# Altium schematic sheet Умножитель.SchDoc: Интерфейсный модуль ФЭУ-92
size A3; Address1: (с) Быканов Андрей; Address2: г.Тула 2016г.; Revision: 1.3
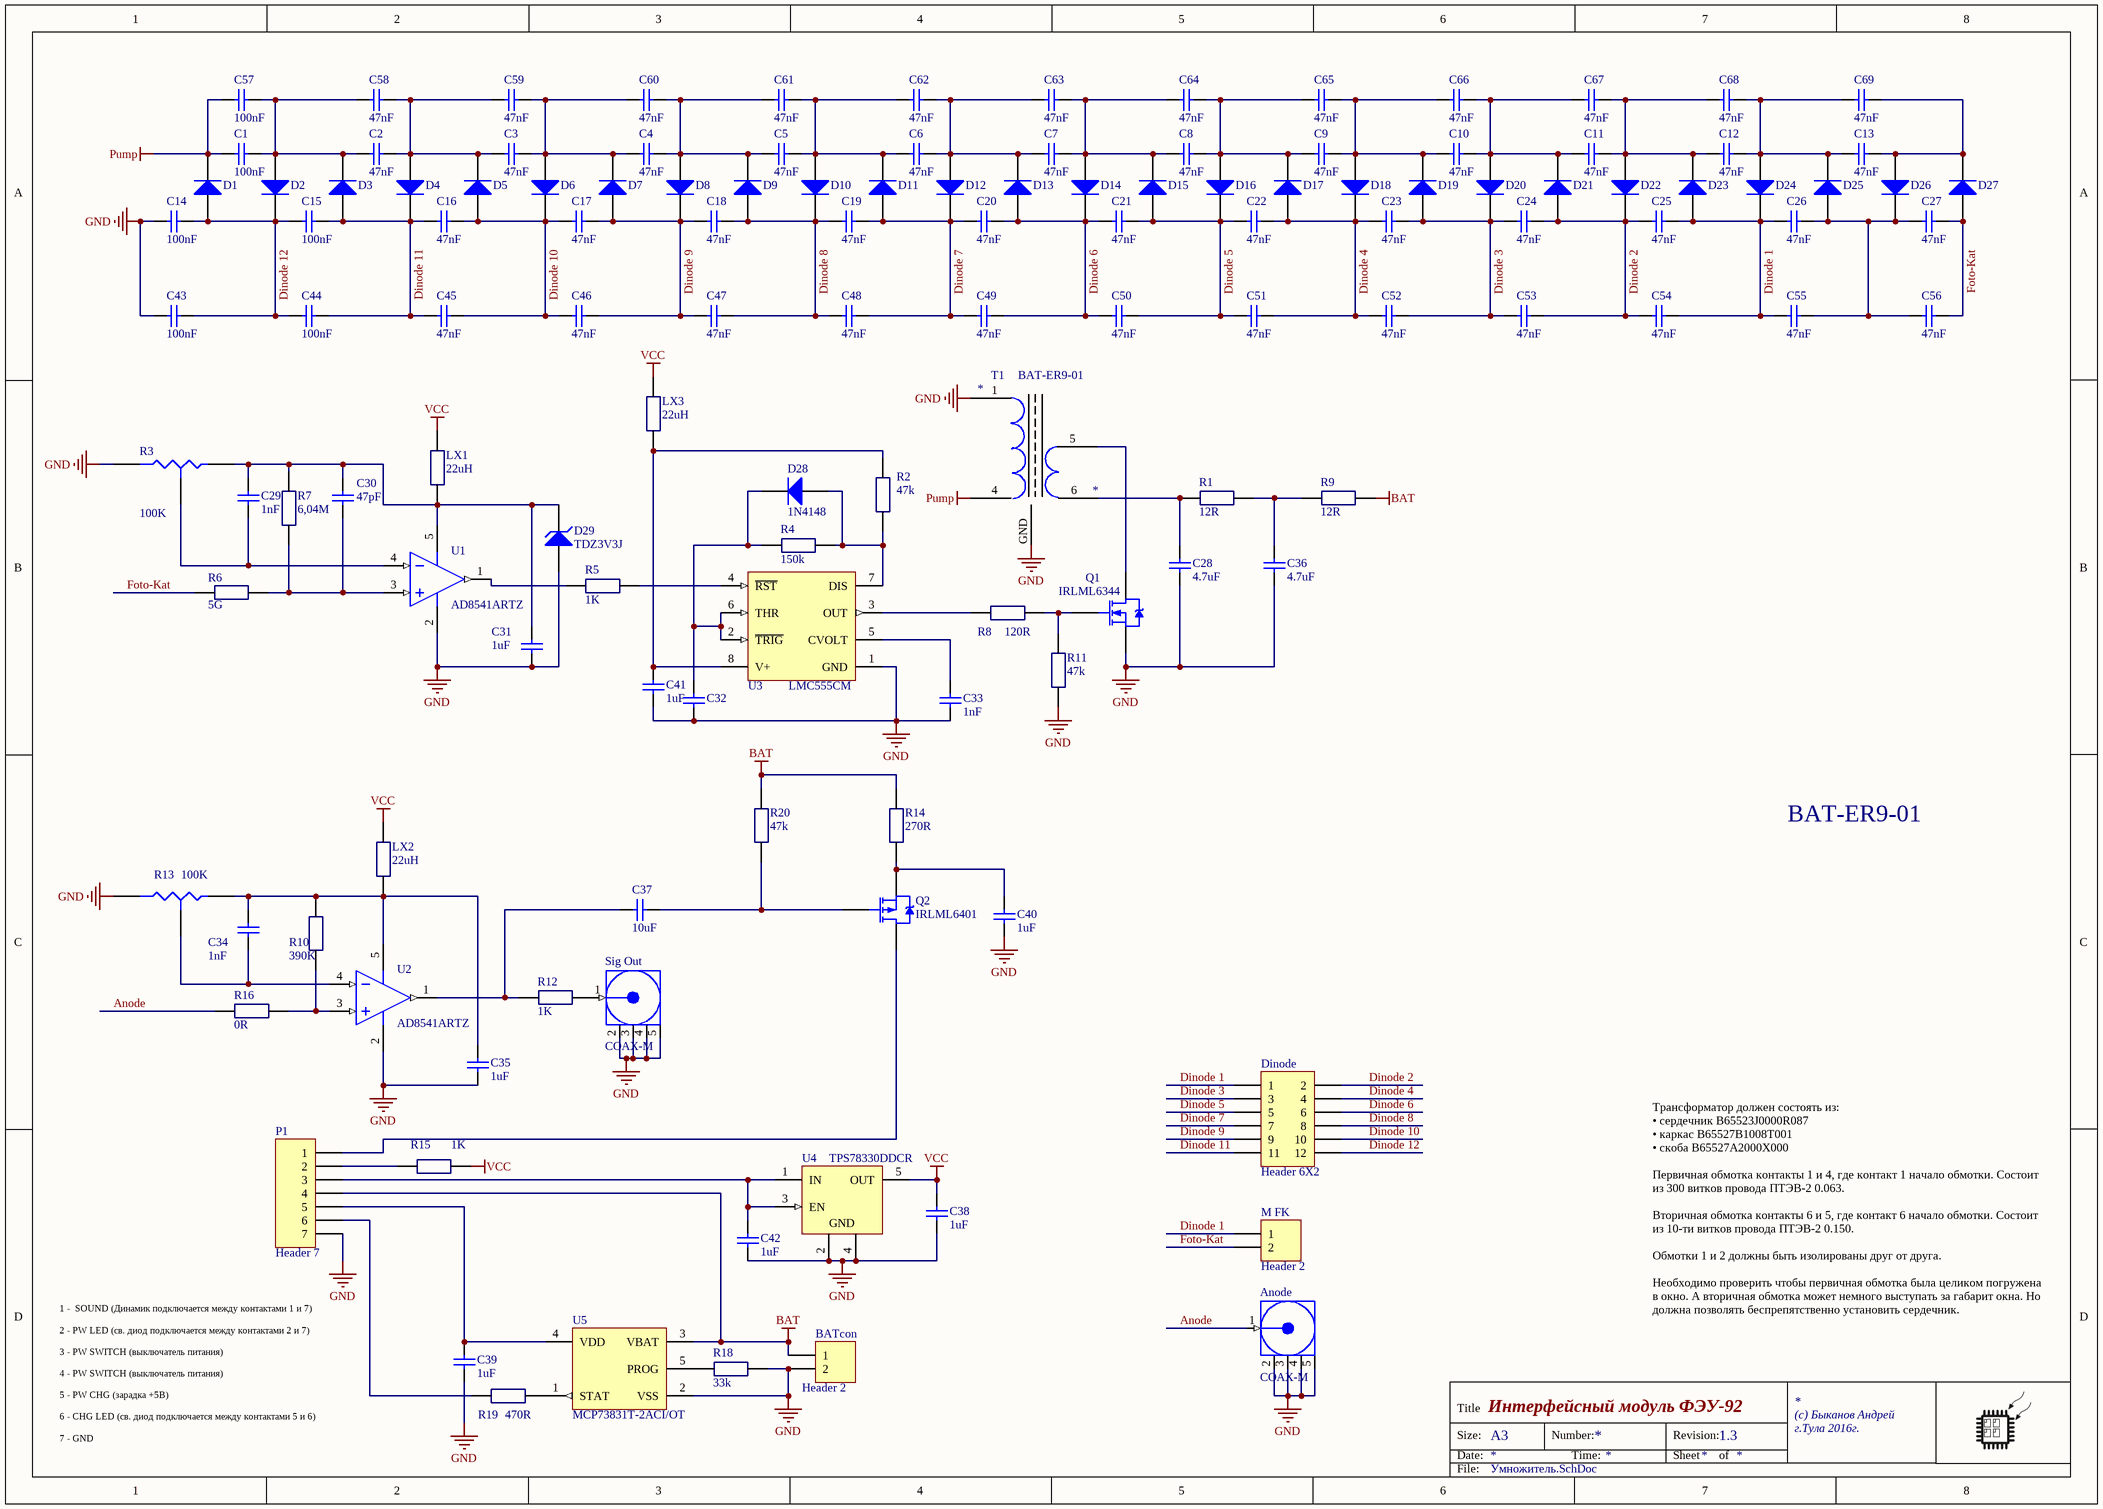
[diagram p0: Умножитель.SchDoc]

## Parts
Anode  COAX-M  [MMCX2.54-V5]  (no BOM)
BATcon  Header 2  [LIR2430]
C1  100nF  [C1206]
C2  47nF  [0805_CAP]
C3  47nF  [0805_CAP]
C4  47nF  [0805_CAP]
C5  47nF  [0805_CAP]
C6  47nF  [0805_CAP]
C7  47nF  [0805_CAP]
C8  47nF  [0805_CAP]
C9  47nF  [0805_CAP]
C10  47nF  [0805_CAP]
C11  47nF  [0805_CAP]
C12  47nF  [0805_CAP]
C13  47nF  [0805_CAP]
C14  100nF  [C1206]
C15  100nF  [C1206]
C16  47nF  [0805_CAP]
C17  47nF  [0805_CAP]
C18  47nF  [0805_CAP]
C19  47nF  [0805_CAP]
C20  47nF  [0805_CAP]
C21  47nF  [0805_CAP]
C22  47nF  [0805_CAP]
C23  47nF  [0805_CAP]
C24  47nF  [0805_CAP]
C25  47nF  [0805_CAP]
C26  47nF  [0805_CAP]
C27  47nF  [0805_CAP]
C28  4.7uF  [C1206]
C29  1nF  [1608[0603]_CAP]
C30  47pF  [1608[0603]_CAP]
C31  1uF  [1608[0603]_CAP]
C32  220pF  [1608[0603]_CAP]  (value not drawn)
C33  1nF  [1608[0603]_CAP]
C34  1nF  [1608[0603]_CAP]
C35  1uF  [1608[0603]_CAP]
C36  4.7uF  [C1206]
C37  10uF  [1608[0603]_CAP]
C38  1uF  [1608[0603]_CAP]
C39  1uF  [1608[0603]_CAP]
C40  1uF  [1608[0603]_CAP]
C41  1uF  [1608[0603]_CAP]
C42  1uF  [1608[0603]_CAP]
C43  100nF  [C1206]
C44  100nF  [C1206]
C45  47nF  [0805_CAP]
C46  47nF  [0805_CAP]
C47  47nF  [0805_CAP]
C48  47nF  [0805_CAP]
C49  47nF  [0805_CAP]
C50  47nF  [0805_CAP]
C51  47nF  [0805_CAP]
C52  47nF  [0805_CAP]
C53  47nF  [0805_CAP]
C54  47nF  [0805_CAP]
C55  47nF  [0805_CAP]
C56  47nF  [0805_CAP]
C57  100nF  [C1206]
C58  47nF  [0805_CAP]
C59  47nF  [0805_CAP]
C60  47nF  [0805_CAP]
C61  47nF  [0805_CAP]
C62  47nF  [0805_CAP]
C63  47nF  [0805_CAP]
C64  47nF  [0805_CAP]
C65  47nF  [0805_CAP]
C66  47nF  [0805_CAP]
C67  47nF  [0805_CAP]
C68  47nF  [0805_CAP]
C69  47nF  [0805_CAP]
D1  (no value)  [DA2JF8100L]
D2  (no value)  [DA2JF8100L]
D3  (no value)  [DA2JF8100L]
D4  (no value)  [DA2JF8100L]
D5  (no value)  [DA2JF8100L]
D6  (no value)  [DA2JF8100L]
D7  (no value)  [DA2JF8100L]
D8  (no value)  [DA2JF8100L]
D9  (no value)  [DA2JF8100L]
D10  (no value)  [DA2JF8100L]
D11  (no value)  [DA2JF8100L]
D12  (no value)  [DA2JF8100L]
D13  (no value)  [DA2JF8100L]
D14  (no value)  [DA2JF8100L]
D15  (no value)  [DA2JF8100L]
D16  (no value)  [DA2JF8100L]
D17  (no value)  [DA2JF8100L]
D18  (no value)  [DA2JF8100L]
D19  (no value)  [DA2JF8100L]
D20  (no value)  [DA2JF8100L]
D21  (no value)  [DA2JF8100L]
D22  (no value)  [DA2JF8100L]
D23  (no value)  [DA2JF8100L]
D24  (no value)  [DA2JF8100L]
D25  (no value)  [DA2JF8100L]
D26  (no value)  [DA2JF8100L]
D27  (no value)  [DA2JF8100L]
D28  1N4148  [GRZZ0002ZB-A]
D29  TDZ3V3J  [SC-90]
Dinode  Header 6X2  [HDR2X6]  (no BOM)
LX1  22uH  [Resistor]
LX2  22uH  [Resistor]
LX3  22uH  [Resistor]
M_FK  Header 2  [HDR1X2]  (no BOM)
P1  Header 7  [HDR1X7]
Q1  IRLML6344  [SOT-23_N]
Q2  IRLML6401  [Micro3_N]
R1  12R  [1608[0603]_RES]
R2  47k  [1608[0603]_RES]
R3  100K  [3223W]
R4  150k  [1608[0603]_RES]
R5  1K  [1608[0603]]
R6  5G  [HVF2512T5007FE]
R7  6,04M  [1608[0603]]
R8  120R  [1608[0603]_RES]
R9  12R  [1608[0603]_RES]
R10  390K  [1608[0603]]
R11  47k  [1608[0603]_RES]
R12  1K  [1608[0603]]
R13  100K  [3223W]
R14  270R  [1608[0603]_RES]
R15  1K  [1608[0603]_RES]
R16  0R  [1608[0603]]
R18  33k  [1608[0603]_RES]
R19  470R  [1608[0603]_RES]
R20  47k  [1608[0603]_RES]
Sig_Out  COAX-M  [MMCX2.54-V5]  (no BOM)
T1  BAT-ER9-01  [Epcos ER9.5/5]
U1  AD8541ARTZ  [ADI-RJ-5_N]
U2  AD8541ARTZ  [ADI-RJ-5_N]
U3  LMC555CM  [M08A_N]
U4  TPS78330DDCR  [TI-DDC5_N]
U5  MCP73831T-2ACI/OT  [SOT-23-OT5_N]

## Nets
BAT: BATcon.1 P1.4 R9.2 R14.2 R20.1(A) U5.3(VBAT)
GND: Anode.2(GND) Anode.3(GND) Anode.4(GND) Anode.5(GND) BATcon.2 C14.2 C28.2 C31.2 C32.1 C33.2 C35.2 C36.2 C38.1 C39.2 C40.2 C41.2 C42.2 C43.2 D29.1(A) P1.7 Q1.2(S) R3.2(B) R11.1(A) R13.2(B) R18.2 Sig_Out.2(GND) Sig_Out.3(GND) Sig_Out.4(GND) Sig_Out.5(GND) T1.1 T1.GND U1.2(-V) U2.2(-V) U3.1(GND) U4.2(GND) U4.4(GND) U5.2(VSS)
Pump: C1.2 C57.2 D1.2(K) T1.4
VCC: C38.2 LX1.1(A) LX2.1(A) LX3.1(A) R15.1(A) U4.5(OUT)
Anode: Anode.1(Signal) R16.1(A)
Dinode 1: C25.1 C26.2 C54.1 C55.2 D23.1(A) D24.2(K) Dinode.1 M_FK.1
Dinode 2: C24.1 C25.2 C53.1 C54.2 D21.1(A) D22.2(K) Dinode.2
Dinode 3: C23.1 C24.2 C52.1 C53.2 D19.1(A) D20.2(K) Dinode.3
Dinode 4: C22.1 C23.2 C51.1 C52.2 D17.1(A) D18.2(K) Dinode.4
Dinode 5: C21.1 C22.2 C50.1 C51.2 D15.1(A) D16.2(K) Dinode.5
Dinode 6: C20.1 C21.2 C49.1 C50.2 D13.1(A) D14.2(K) Dinode.6
Dinode 7: C19.1 C20.2 C48.1 C49.2 D11.1(A) D12.2(K) Dinode.7
Dinode 8: C18.1 C19.2 C47.1 C48.2 D9.1(A) D10.2(K) Dinode.8
Dinode 9: C17.1 C18.2 C46.1 C47.2 D7.1(A) D8.2(K) Dinode.9
Dinode 10: C16.1 C17.2 C45.1 C46.2 D5.1(A) D6.2(K) Dinode.10
Dinode 11: C15.1 C16.2 C44.1 C45.2 D3.1(A) D4.2(K) Dinode.11
Dinode 12: C14.1 C15.2 C43.1 C44.2 D1.1(A) D2.2(K) Dinode.12
Foto-Kat: C27.1 C56.1 D27.1(A) M_FK.2 R6.1(A)
NetC1_1: C1.1 C2.2 C57.1 C58.2 D2.1(A) D3.2(K)
NetC2_1: C2.1 C3.2 C58.1 C59.2 D4.1(A) D5.2(K)
NetC3_1: C3.1 C4.2 C59.1 C60.2 D6.1(A) D7.2(K)
NetC4_1: C4.1 C5.2 C60.1 C61.2 D8.1(A) D9.2(K)
NetC5_1: C5.1 C6.2 C61.1 C62.2 D10.1(A) D11.2(K)
NetC6_1: C6.1 C7.2 C62.1 C63.2 D12.1(A) D13.2(K)
NetC7_1: C7.1 C8.2 C63.1 C64.2 D14.1(A) D15.2(K)
NetC8_1: C8.1 C9.2 C64.1 C65.2 D16.1(A) D17.2(K)
NetC9_1: C9.1 C10.2 C65.1 C66.2 D18.1(A) D19.2(K)
NetC10_1: C10.1 C11.2 C66.1 C67.2 D20.1(A) D21.2(K)
NetC11_1: C11.1 C12.2 C67.1 C68.2 D22.1(A) D23.2(K)
NetC12_1: C12.1 C13.2 C68.1 C69.2 D24.1(A) D25.2(K)
NetC13_1: C13.1 C69.1 D26.1(A) D27.2(K)
NetC26_1: C26.1 C27.2 C55.1 C56.2 D25.1(A) D26.2(K)
NetC28_1: C28.1 R1.1(A) T1.6
NetC29_1: C29.1 C30.1 C31.1 D29.2(K) LX1.2 R3.1(A) R7.1(A) U1.5(+V)
NetC29_2: C29.2 R3.3(TAP) U1.4(-IN_A)
NetC30_2: C30.2 R6.2 R7.2 U1.3(+IN_A)
NetC32_2: C32.2 D28.1(K) R4.1(A) U3.2(~{TRIG}) U3.6(THR)
NetC33_1: C33.1 U3.5(CVOLT)
NetC34_1: C34.1 C35.1 LX2.2 R10.2 R13.1(A) U2.5(+V)
NetC34_2: C34.2 R13.3(TAP) U2.4(-IN_A)
NetC36_1: C36.1 R1.2 R9.1(A)
NetC37_1: C37.1 R12.2 U2.1(OUT_A)
NetC37_2: C37.2 Q2.1(G) R20.2
NetC39_1: C39.1 P1.5 U5.4(VDD)
NetC40_1: C40.1 Q2.2(S) R14.1(A)
NetC41_1: C41.1 LX3.2 R2.2 U3.8(V+)
NetC42_1: C42.1 P1.3 U4.1(IN) U4.3(EN)
NetD28_2: D28.2(A) R2.1(A) R4.2 U3.7(DIS)
NetP1_1: P1.1 Q2.3(D)
NetP1_2: P1.2 R15.2
NetP1_6: P1.6 R19.2
NetQ1_1: Q1.1(G) R8.1(A) R11.2
NetQ1_3: Q1.3(D) T1.5
NetR5_1: R5.1(A) U1.1(OUT_A)
NetR5_2: R5.2 U3.4(~{RST})
NetR8_2: R8.2 U3.3(OUT)
NetR10_1: R10.1(A) R16.2 U2.3(+IN_A)
NetR12_1: R12.1(A) Sig_Out.1(Signal)
NetR18_1: R18.1(A) U5.5(PROG)
NetR19_1: R19.1(A) U5.1(STAT)

## Notes on the sheet
- BAT-ER9-01
- Трансформатор должен состоять из:
  •	сердечник B65523J0000R087
  •	каркас B65527B1008T001
  •	скоба B65527A2000X000
  Первичная обмотка контакты 1 и 4, где контакт 1 начало обмотки. Состоит из 300 витков провода ПТЭВ-2 0.063.
  Вторичная обмотка контакты 6 и 5, где контакт 6 начало обмотки. Состоит из 10-ти витков провода ПТЭВ-2 0.150.
  Обмотки 1 и 2 должны быть изолированы друг от друга.
  Необходимо проверить чтобы первичная обмотка была целиком погружена в окно. А вторичная обмотка может немного выступать за габарит окна. Но должна позволять беспрепятственно установить сердечник.
- 1 -  SOUND (Динамик подключается между контактами 1 и 7)
  2 - PW LED (св. диод подключается между контактами 2 и 7)
  3 - PW SWITCH (выключатель питания)
  4 - PW SWITCH (выключатель питания)
  5 - PW CHG (зарадка +5В)
  6 - CHG LED (св. диод подключается между контактами 5 и 6)
  7 - GND
- Title
- Size:
- Date:
- A3
- Number:
- Time:
- Revision:
- Sheet
- of
- File:

## Library data of the parts
Anode Sig_Out = COAX-M: RF Coaxial PCB Connector, MMCX; Thru-Hole, Vertical Mount Plug,  50 Ohm Impedance; PackageDocument: Rev. A, 16-Jun-1997; PCB_Layout: Complies with manufacturer's recommendation.; DrillSize: Corresponds to nominal value.; Published: 15-Jul-2004; LatestRevisionDate: 15-Jul-2004; LatestRevisionNote: Component Replaced.; DatasheetDocument: 30-May-2003; PackageReference: 908-21103; Publisher: Altium Limited; ComponentLink1Description: Manufacturer Link; ComponentLink1URL: http://www.amphenolrf.com/
BATcon M_FK = Header 2: Header, 2-Pin; LatestRevisionDate: 17-Jul-2002; LatestRevisionNote: Re-released for DXP Platform.; Publisher: Altium Limited
  BATcon: Order: LIR2430
C1 C14 C15 C43 C44 C57 = Cap Semi: Capacitor (Semiconductor SIM Model); Order: CGA5L4X7T2W104K; Published: 8-Jun-2000; LatestRevisionDate: 29-May-2009; LatestRevisionNote: IPC-7351 Footprint Added.; PackageReference: C1206; Publisher: Altium Limited; PackageDescription: Chip Capacitor; Value: 100nF
C2-C13 C16-C27 C45-C56 C58-C69 = Cap Semi: Capacitor (Semiconductor SIM Model); Order: CGA4J4X7T2W473M/SOFT; Published: 8-Jun-2000; LatestRevisionDate: 29-May-2009; LatestRevisionNote: IPC-7351 Footprint Added.; PackageReference: C1206; Publisher: Altium Limited; PackageDescription: Chip Capacitor; Value: 47nF
C28 C36 = Cap Semi: Capacitor (Semiconductor SIM Model); Order: CC1206KKX7R8BB475; Published: 8-Jun-2000; LatestRevisionDate: 29-May-2009; LatestRevisionNote: IPC-7351 Footprint Added.; PackageReference: C1206; Publisher: Altium Limited; PackageDescription: Chip Capacitor; Value: 4.7uF
C29 C33 C34 = Cap Semi: Capacitor (Semiconductor SIM Model); Order: CC0603JRNPO9BN102; Published: 8-Jun-2000; LatestRevisionDate: 29-May-2009; LatestRevisionNote: IPC-7351 Footprint Added.; Publisher: Altium Limited; PackageDescription: Chip Capacitor; Value: 1nF
  C29 C34: PackageReference: C0402
  C33: PackageReference: C1206
C30 = Cap Semi: Capacitor (Semiconductor SIM Model); Order: CC0603JRNPOABN470; Published: 8-Jun-2000; LatestRevisionDate: 29-May-2009; LatestRevisionNote: IPC-7351 Footprint Added.; PackageReference: C0402; Publisher: Altium Limited; PackageDescription: Chip Capacitor; Value: 47pF
C31 C35 C38-C42 = Cap Semi: Capacitor (Semiconductor SIM Model); Order: CC0603KRX5R7BB105; Published: 8-Jun-2000; LatestRevisionDate: 29-May-2009; LatestRevisionNote: IPC-7351 Footprint Added.; Publisher: Altium Limited; PackageDescription: Chip Capacitor; Value: 1uF
  C31 C35: PackageReference: C1206
  C38-C42: PackageReference: C0402
C32 = Cap Semi: Capacitor (Semiconductor SIM Model); Order: CC0603JRNPO9BN221; Published: 8-Jun-2000; LatestRevisionDate: 29-May-2009; LatestRevisionNote: IPC-7351 Footprint Added.; PackageReference: C1206; Publisher: Altium Limited; PackageDescription: Chip Capacitor; Value: 220pF
C37 = Cap Semi: Capacitor (Semiconductor SIM Model); Order: GRM188R60J106ME47D; Published: 8-Jun-2000; LatestRevisionDate: 29-May-2009; LatestRevisionNote: IPC-7351 Footprint Added.; PackageReference: C0402; Publisher: Altium Limited; PackageDescription: Chip Capacitor; Value: 10uF
D1-D27 = Diode: Default Diode; Value: DA2JF8100L; Published: 8-Jun-2000; LatestRevisionDate: 17-Jul-2002; LatestRevisionNote: Re-released for DXP Platform.; PackageVersion: Sep-1996; PackageReference: SMC; Publisher: Altium Limited; PackageDescription: DO-214-AB/SMC; 2 C-Bend Leads; Body 7.9 x 5.9 mm, inc. leads (LxW); Code_JEDEC: DO-214-AB; Order: DA2JF8100L
D28 = 1N4148: Silicon Epitaxial Planar Diode for Various Detector, Modulator, Demodulator; Published: 12-Feb-2010; DatasheetVersion: Rev.5.00, Jul-2006; PackageVersion: Aug-2005; PackageReference: GRZZ0002ZB-A; Publisher: Altium Limited; PackageDescription: Diode, Axial; Body 4.2 x 2.0 mm (LxDia.), Lead Dia. 0.5 mm (nom); Code_JEITA: SC-40; ComponentLink1Description: Manufacturer Link; ComponentLink1URL: http://sg.renesas.com/fmwk.jsp?cnt=diode_landing.jsp&fp=/products/discrete/diodes/; ComponentLink2Description: Datasheet; ComponentLink2URL: http://documentation.renesas.com/eng/products/diode/rej03g0556_1n4148.pdf; ComponentLink3Description: Packaging Specification; ComponentLink3URL: http://sg.renesas.com/media/products/common_info/package/pdf/diode/code/grzz0002zb_a.pdf; Order: 1N4148
D29 = D Zener: Zener Diode; Published: 8-Jun-2000; LatestRevisionDate: 17-Jul-2002; LatestRevisionNote: Re-released for DXP Platform.; PackageReference: DIODE-0.7; Publisher: Altium Limited; PackageDescription: Diode, Thru-Hole; 2 Leads; 0.7 in Pin Spacing; Order: TDZ3V3J
Dinode = Header 6X2: Header, 6-Pin, Dual row; LatestRevisionDate: 17-Jul-2002; LatestRevisionNote: Re-released for DXP Platform.; Publisher: Altium Limited
LX1-LX3 = Resistor 0805: Order: LQM21FN220N00L; Value: 22uH
P1 = Header 7: Header, 7-Pin; LatestRevisionDate: 17-Jul-2002; LatestRevisionNote: Re-released for DXP Platform.; Publisher: Altium Limited
Q1 = IRLML2402: HEXFET Power MOSFET; Published: 8-Jun-2000; LatestRevisionDate: 20-Nov-2009; LatestRevisionNote: IPC-7351 Footprint Added.; DatasheetVersion: Aug-1997; PackageReference: SOT-23; Publisher: Altium Limited; PackageDescription: 3-Pin SOT-23 Package 0.95 mm Pitch, 2.3 mm Lead Span; ComponentLink1Description: Manufacturer Link; ComponentLink1URL: http://www.irf.com/; ComponentLink2Description: Datasheet; ComponentLink2URL: http://www.irf.com/product-info/datasheets/data/irlml2402.pdf; Order: IRLML6344
Q2 = IRLML6401: HEXFET Power MOSFET; Published: 17-Sep-2003; DatasheetVersion: 2-Jul-2001; PackageVersion: Jul-2001; PackageReference: Micro3; Publisher: Altium Limited; PackageDescription: 3-Pin SOT-23 Package 0.95 mm Pitch, 2.3 mm Lead Span; ComponentLink1Description: Manufacturer Link; ComponentLink1URL: http://www.irf.com/; ComponentLink2Description: Datasheet; ComponentLink2URL: http://www.irf.com/product-info/datasheets/data/IRLML6401.pdf; Order: IRLML6401
R1 R9 = Resistor 0805: Order: ERJ3GEYJ120V; Avail: 20; Value: 12R
R2 R11 R20 = Resistor 0805: Order: RC0603FR-0747KL; Avail: 20; Value: 47k
R3 R13 = Res Tap: Tapped Resistor; Sim Note: Enter the Resistance value and the set point into parameter fields.; Set Position: 0.5; Order: 3223W-1-104E; Published: 24-Mar-1999; LatestRevisionDate: 17-Jul-2002; LatestRevisionNote: Re-released for DXP Platform.; PackageReference: VR3; Publisher: Altium Limited; PackageDescription: Variable Resistor, Thru-Hole; 3 Leads; Value: 100K
R4 = Resistor 0805: Order: RC0603FR-07150KL; Avail: 20; Value: 150k
R5 R12 = Resistor 0805: Order: RC0603FR-101KL; Value: 1K
R6 = Resistor 0805: Order: HVF2512T5007FE; Value: 5G
R7 = Resistor 0805: Order: CRCW06036M04FKEA; Value: 6,04M
R8 = Resistor 0805: Order: RC0603FR-07120RL; Value: 120R
R10 = Resistor 0805: Order: RC0603FR-07390KL; Value: 390K
R14 = Resistor 0805: Order: RC0805FR-07270RL; Avail: 20; Value: 270R
R15 = Resistor 0805: Order: RC0603FR-101KL; Avail: 20; Value: 1K
R16 = Resistor 0805: Order: RC0603JR-100RL; Value: 0R
R18 = Resistor 0805: Order: RC0603FR-0733KL; Avail: 20; Value: 33k
R19 = Resistor 0805: Order: RC0603JR-07470RL; Value: 470R
T1 = Epcos ER9.5/5: Order: BAT-ER9-01
U1 U2 = AD8541ARTZ-R2: Single Channel RRIO Operational Amplifier, 1 MHz BW, 920 mV/us SR, Industrial, 5-pin SOT23 (RJ-5), Reel; Generic Part Number: AD8541; Manufacturer: Analog Devices; Amplifiers Per Package: 1; Input Bias Current: 4pA; Input Offset Voltage: 1mV; Iq/Amp: 65uA; Small Signal Bandwidth: 1MHz; V Span Max: 5.5V; V Span Min: 2.7V; DatasheetVersion: Rev. G; PackageVersion: 121608-A; PackageReference: RJ-5; PackageDescription: 5-Pin Small Outline Transistor Package, Body 2.9 x 1.6 mm, Pitch 0.95 mm; Supplier 1: Digi-Key; Supplier Part Number 1: AD8541ARTZ-R2TR-ND; Supplier 2: Digi-Key; Supplier Part Number 2: AD8541ARTZ-R2CT-ND; Supplier 3: Digi-Key; Supplier Part Number 3: AD8541ARTZ-R2DKR-ND; Supplier 4: Farnell; Supplier Part Number 4: 1837434; Supplier 5: Newark; Supplier Part Number 5: 59K6820; Slew Rate: 920mV/us; Mounting Technology: Surface Mount; Code_JEDEC: MO-178-AA; PartNumber: AD8541ARTZ-R2; ComponentLink1Description: Manufacturer URL; ComponentLink1URL: http://www.analog.com/en/index.html; ComponentLink2Description: Datasheet; ComponentLink2URL: http://www.analog.com/static/imported-files/data_sheets/AD8541_8542_8544.pdf; ComponentLink3Description: Package Specification; ComponentLink3URL: http://www.analog.com/static/imported-files/packages/PKG_PDF/SOT-23(RJ)/RJ_5.pdf; ComponentLink4Description: Reference Circuit; ComponentLink4URL: http://www.analog.com/en/all-operational-amplifiers-op-amps/operational-amplifiers-op-amps/ad8541/products/product.html#product-recommendations; Order: AD8541ARTZ
U3 = LMC555CM: CMOS Timer, 8-pin Narrow SOIC; Manufacturer: National Semiconductor; PackageTopMarking: NSZXTT*LMC*555CM; PowerWise: N; CompType: Analog IC; Published: 4-Dec-2008; DatasheetVersion: May-2006; PackageVersion: revM, May-2009; PackageReference: M08A; Publisher: Altium Limited; PackageDescription: SOIC Narrow, 4.9 x 3.9 x 1.45mm, 8 Lead, 1.27mm Pitch; Supplier 1: Farnell; Supplier Part Number 1: 9493972; PartNumber: LMC555CM; RoHS: N; PinCount: 8; Code_JEDEC: MS-012-AA; Code_IPC: SOIC127P600-8; ComponentLink1Description: LMC555 Datasheet; ComponentLink1URL: http://www.national.com/ds/LM/LMC555.pdf; ComponentLink2Description: LMC555 Web Page; ComponentLink2URL: http://www.national.com/pf/LM/LMC555.html; ComponentLink3Description: M08A Package Page; ComponentLink3URL: http://www.national.com/packaging/folders/m08a.html; Order: LMC555CM
U4 = TPS78330DDCR: Single Output LDO, 150 mA, Fixed 3 V Output, 2.2 to 5.5 V Input, with Ultra-Low IQ, 5-pin SOT (DDC), -40 to 105 degC, Green (RoHS & no Sb/Br); Manufacturer: Texas Instruments; Accuracy(%): 3; Iout(Max)(A): 0.15; Iq(Typ)(mA): 0.0005; Rating: Catalog; SubFamily: Single Channel LDO; Vdo(Typ)(mV): 130; Vin(Max)(V): 5.5; Vin(Min)(V): 2.2; DatasheetVersion: SBVS133; PackageVersion: 4204403-2/E; PackageReference: DDC5; PackageDescription: 5-Pin Plastic Small Outline, Body 2.9 x 1.6 mm, 0.95 mm Pitch; Supplier 1: Digi-Key; Supplier Part Number 1: 296-25880-2-ND; Supplier 2: Digi-Key; Supplier Part Number 2: 296-25880-1-ND; Supplier 3: Digi-Key; Supplier Part Number 3: 296-25880-6-ND; Supplier 4: Newark; Supplier Part Number 4: 72R6681; Supplier 5: Mouser; Supplier Part Number 5: 595-TPS78330DDCR; Eco-Plan: Green (RoHS & no Sb/Br); Fixed Output Options(V): 3; Vout Adj(Max)(V): 3; Vout Adj(Min)(V): 3; Mounting Technology: Surface Mount; Code_JEDEC: MO-193; PartNumber: TPS78330DDCR; ComponentLink1Description: Manufacturer URL; ComponentLink1URL: http://www.ti.com/; ComponentLink2Description: Datasheet; ComponentLink2URL: http://www.ti.com/general/docs/lit/getliterature.tsp?genericPartNumber=TPS78330&fileType=pdf; ComponentLink3Description: Package Specification; ComponentLink3URL: http://www.ti.com/litv/pdf/mpds123d; Order: TPS78330DDCR
U5 = MCP73831T-2ACI/OT: Miniature Single-Cell, Fully Integrated Li-Ion, Li-Polymer Charge Management Controller, 4.2V, 5-Pin SOT-23, Industrial Temperature, Tape and Reel; Published: 29-Jan-2009; LatestRevisionDate: 27-Nov-2009; LatestRevisionNote: Updated to datasheet revision E, Sep-2008; DatasheetVersion: revE, Sep-2008; PackageVersion: revBB, Aug-2009; PackageReference: SOT-23-OT5; Publisher: Altium Limited; PackageDescription: 5-Lead Plastic Small Outline Transistor (OT) [SOT-23]; Supplier 1: Digi-Key; Supplier Part Number 1: MCP73831T-2ACI/OTTR-ND; Supplier 2: Digi-Key; Supplier Part Number 2: MCP73831T-2ACI/OTCT-ND; Supplier 3: Digi-Key; Supplier Part Number 3: MCP73831T-2ACI/OTDKR-ND; Supplier 4: Farnell; Supplier Part Number 4: 1332158; Code_IPC: SOT23-5; ComponentLink1Description: Datasheet; ComponentLink1URL: http://ww1.microchip.com/downloads/en/DeviceDoc/21984e.pdf; ComponentLink2Description: Packaging Specification; ComponentLink2URL: http://www.microchip.com/stellent/groups/techpub_sg/documents/packagingspec/en012702.pdf; ComponentLink3Description: Microchip.com Home; ComponentLink3URL: http://www.microchip.com/; Order: MCP73831T-2ACI/OT